# EAGLE design esp8266S_2A_noGND (EAGLE 7.5.0)
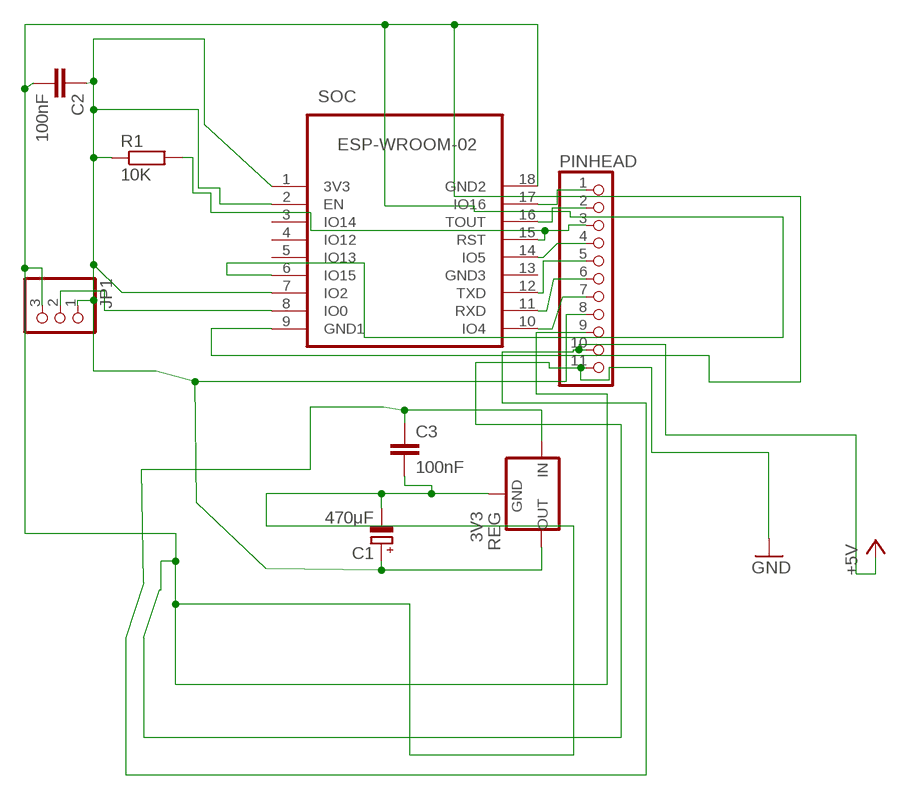
[diagram p0: schematic, sheet 1]

## Parts
C1  470μF  CPOL-EUE2.5-7  [E2,5-7]
C2  100nF  C-EUC0603  [C0603]
C3  100nF  C-EUC0603  [C0603]
JP1  PINHD-1X3  [1X03]
PINHEAD  PINHD-1X11  [1X11]
R1  10K  R-EU_R0603  [R0603]
REG  3V3  78XXS  [78XXS]
SOC  ESP-WROOM-02  ESP-WROOM-02-CP2FRONT  [FRONT-FACE-CP2]

## Nets
+5V: C3.1 PINHEAD.10 REG.IN
GND: C1.- C2.2 C3.2 JP1.3 PINHEAD.9 PINHEAD.11 REG.GND SOC.6(IO15) SOC.9(GND1) SOC.18(GND2)
N$1: JP1.2 SOC.8(IO0)
N$6: PINHEAD.1 SOC.17(IO16)
N$7: PINHEAD.2 SOC.16(TOUT)
N$8: PINHEAD.4 SOC.14(IO5)
N$9: PINHEAD.5 SOC.12(TXD)
N$10: PINHEAD.6 SOC.11(RXD)
N$11: PINHEAD.7 SOC.10(IO4)
N$12: C1.+ C2.1 JP1.1 PINHEAD.8 R1.1 REG.OUT SOC.1(3V3) SOC.2(EN) SOC.7(IO2)
N$13: PINHEAD.3 R1.2 SOC.15(RST)
Unconnected: SOC.3(IO14) SOC.4(IO12) SOC.5(IO13) SOC.13(GND3)

## Library data of the parts
C1 = rcl:CPOL-EU: POLARIZED CAPACITOR, European symbol
C2 C3 = resistor:C-EU: CAPACITOR, European symbol
JP1 = pinhead:PINHD-1X3: PIN HEADER
PINHEAD = pinhead:PINHD-1X11: PIN HEADER
R1 = resistor:R-EU_: RESISTOR, European symbol
REG = v-reg:78XXS: VOLTAGE REGULATOR
SOC = esp-wroom-02-CP2:ESP-WROOM-02-CP2: WiFi module - ESP-WROOM-02

## Board
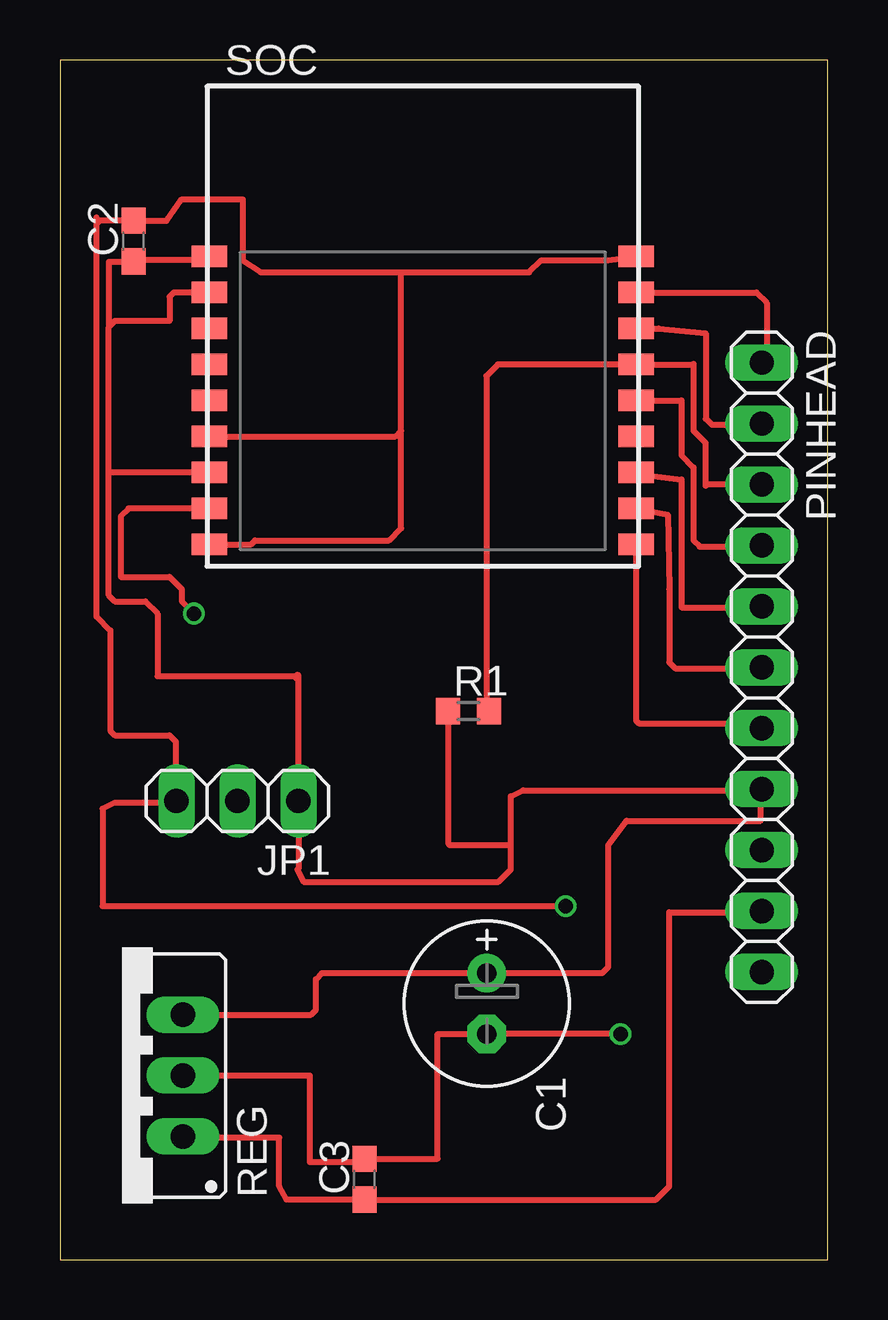
[diagram p1: board, top side]
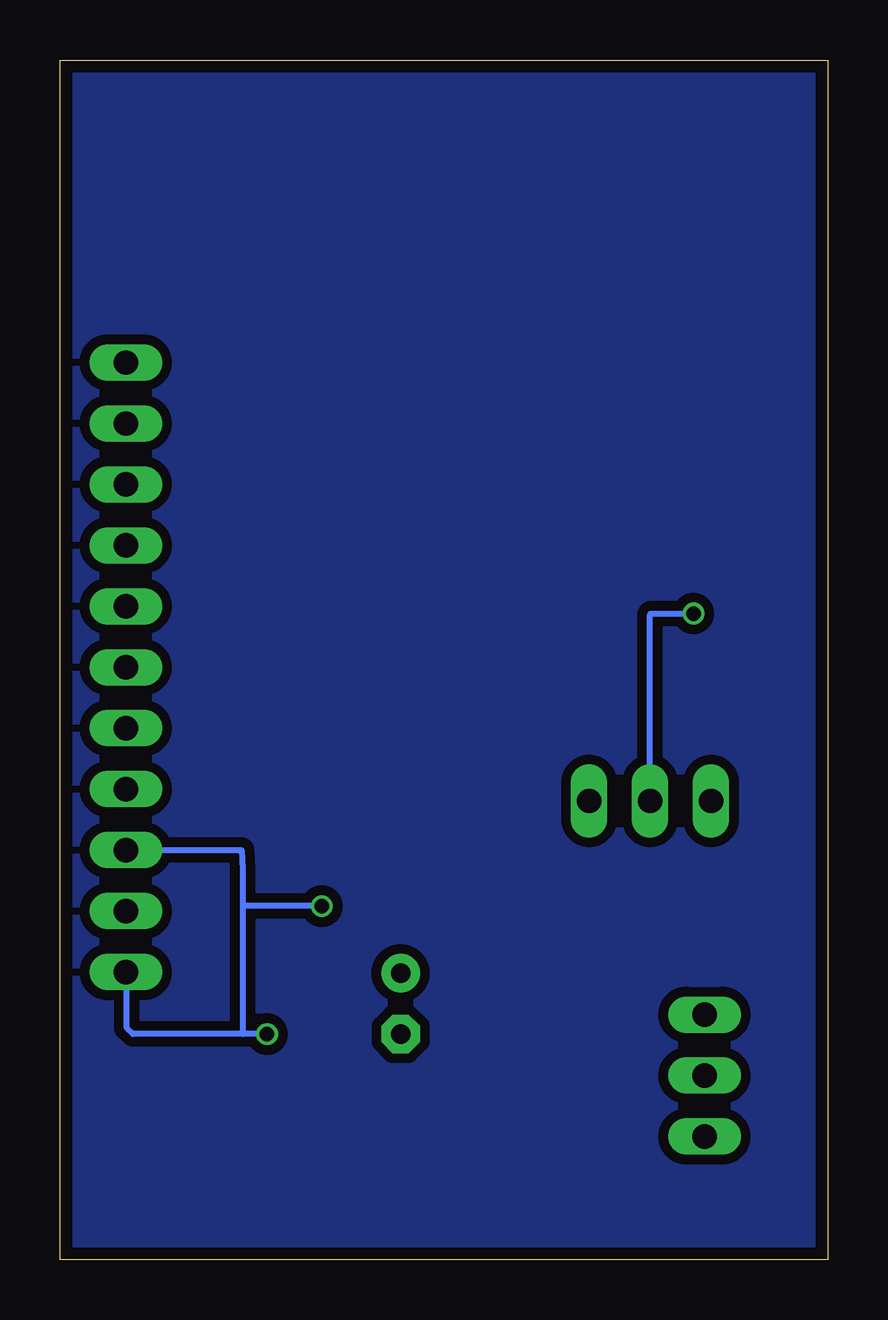
[diagram p2: board, bottom side, seen from below]

Size 32 x 50 mm. Coordinates in mm from the lower left corner, seen from the top.
Outline: 0,0 32,0 32,50 0,50 0,0
Copper layers (1*16): Top 0.035mm / dielectric 1.6mm / Bottom 0.035mm
Design rules "Elecrow_2-layer_PCB_eagle_rule": minimum track width 6mil, minimum drill 12mil, track to track 6mil, track to pad 6mil, pad to pad 6mil, via to via 8mil, smd to smd 0mil, copper to edge 20mil, drill to drill 10mil, minimum pad ring 6mil, minimum via ring 6mil, stop-mask expansion 0mil, vias tented up to drill 100mil, thermal gap 10mil

### Footprints (pad centres in the part's own frame; a part is rotated, then mirrored left to right if it is on the bottom)
E2,5-7 = drill 0.813 pad 1.6: + -1.27,0 | drill 0.813 pad 1.6 octagon: - 1.27,0
C0603 = smd 1.1 x 1: 1 -0.85,0; 2 0.85,0
1X03 = drill 1.016 long: 1 -2.54,0; 2 0,0; 3 2.54,0
1X11 = drill 1.016 long: 1 -12.7,0; 2 -10.16,0; 3 -7.62,0; 4 -5.08,0; 5 -2.54,0; 6 0,0; 7 2.54,0; 8 5.08,0; 9 7.62,0; 10 10.16,0; 11 12.7,0
R0603 = smd 1 x 1.1: 1 -0.85,0; 2 0.85,0
78XXS = drill 1.016 long: GND 0,-2.54; IN -2.54,-2.54; OUT 2.54,-2.54
FRONT-FACE-CP2 = smd 1.485 x 0.9: 1 -8.893,4.9; 2 -8.893,3.4; 3 -8.893,1.9; 4 -8.893,0.4; 5 -8.893,-1.1; 6 -8.893,-2.6; 7 -8.893,-4.1; 8 -8.893,-5.6; 9 -8.893,-7.1; 10 8.893,-7.1; 11 8.893,-5.6; 12 8.893,-4.1; 13 8.893,-2.6; 14 8.893,-1.1; 15 8.893,0.4; 16 8.893,1.9; 17 8.893,3.4; 18 8.893,4.9

### Placement (x,y rotation side)
C1  17.8,10.67 270 top
C2  3.06,42.45 90 top
C3  12.7,3.35 90 top
JP1  7.4,19.11 180 top
PINHEAD  29.26,24.69 270 top
R1  17.03,22.86 0 top
REG  2.59,7.67 90 top
SOC  15.13,36.91 0 top

### Tracks (layer width: path | path; a pad name or v marks a point on that pad's centre or on a via)
+5V
  Top 0.254: REG.IN 5.18,5.08 9.14,5.08 9.14,3.05 9.44,2.5 C3.1 24.85,2.5 25.4,3.05 25.4,14.48 29.26,14.48 PINHEAD.10 29.21,14.48
GND  (via drill 0.6)
  Top 0.254: v23.37,9.4 C1.- 15.75,9.4 15.75,4.2 C3.2 12.7,4.06 10.41,4.06 10.41,7.67 REG.GND 5.08,7.62 | 1.52,43.18 1.52,26.8 2.1,26.23 2.1,22.03 2.29,21.84 4.57,21.84 4.83,21.59 4.83,19.15 JP1.3 4.79,19.05 2.29,19.05 1.78,18.8 1.78,14.73 v21.08,14.73 | 1.52,43.18 1.52,43.43 | 14.22,41.15 8.38,41.15 7.62,41.66 7.62,44.2 5.08,44.2 4.44,43.3 C2.2 1.65,43.3 1.52,43.18 | 14.22,41.15 19.56,41.15 20.07,41.66 22.85,41.66 SOC.18 | SOC.9 7.96,29.81 8.13,29.97 13.72,29.97 14.22,30.48 14.22,34.54 | 14.22,34.54 14.22,41.15 | SOC.6 13.99,34.31 14.22,34.54
  Bottom 0.254: v23.37,9.4 24.38,9.4 | 24.38,9.4 28.96,9.4 29.21,9.65 29.21,11.94 PINHEAD.11 | v21.08,14.73 24.38,14.73 | 24.38,14.73 24.38,9.4 | PINHEAD.9 24.43,17.07 24.38,16.26 24.38,14.73
N$1  (via drill 0.6)
  Top 0.254: SOC.8 2.86,31.31 2.54,30.99 2.54,28.45 4.57,28.45 5.08,27.94 5.08,27.43 v5.59,26.92
  Bottom 0.254: JP1.2 7.4,26.89 7.37,26.92 v5.59,26.92
N$2
  pour Bottom (isolate 0.406, no thermals): 0,50 0,0 32,0 32,50
N$6
  Top 0.254: SOC.17 29.04,40.31 29.46,39.88 29.46,37.59 PINHEAD.1
N$7
  Top 0.254: SOC.16 24.95,38.81 26.92,38.61 26.92,35.05 27.18,34.8 29.21,34.8 PINHEAD.2
N$8
  Top 0.254: SOC.14 25.9,35.81 25.91,35.81 25.91,33.53 26.42,33.02 26.42,29.97 26.67,29.72 29.21,29.72 PINHEAD.4
N$9
  Top 0.254: SOC.12 23.58,32.81 25.91,32.51 25.91,27.18 29.21,27.18 PINHEAD.5
N$10
  Top 0.254: SOC.11 25.34,31.05 25.4,27.94 25.4,24.89 25.65,24.64 29.21,24.64 PINHEAD.6
N$11
  Top 0.254: SOC.10 24.02,22.46 24.13,22.35 29.05,22.35 PINHEAD.7
N$12
  Top 0.254: REG.OUT 10.46,10.21 10.67,10.41 10.67,11.68 10.92,11.94 C1.+ 22.61,11.94 22.86,12.19 22.86,17.27 23.62,18.29 29.21,18.29 29.21,19.56 | 9.94,24.13 JP1.1 9.94,16.29 9.91,16.26 10.16,15.75 18.29,15.75 18.8,16.26 18.8,17.27 | 9.94,24.13 9.94,24.35 9.91,24.38 | 9.94,24.13 9.75,24.31 4.06,24.31 4.06,26.92 3.56,27.43 2.29,27.43 2.03,27.69 2.03,32.77 | 2.03,32.77 2.03,38.86 | SOC.7 2.07,32.81 2.03,32.77 | SOC.1 6.08,41.66 3.12,41.66 C2.1 2.03,41.59 2.03,38.86 | 18.8,17.27 18.8,19.3 19.3,19.56 29.21,19.56 | 29.21,19.56 PINHEAD.8 | R1.1 16.18,17.34 16.26,17.27 18.8,17.27 | SOC.2 4.75,40.31 4.57,40.13 4.57,39.12 2.29,39.12 2.03,38.86
N$13
  Top 0.254: R1.2 17.78,22.96 17.78,36.83 18.26,37.31 SOC.15 26.38,37.31 26.42,37.34 26.42,34.54 26.92,34.04 26.92,32.26 26.97,32.31 PINHEAD.3